# EAGLE design Schematic (EAGLE 9.6.2)
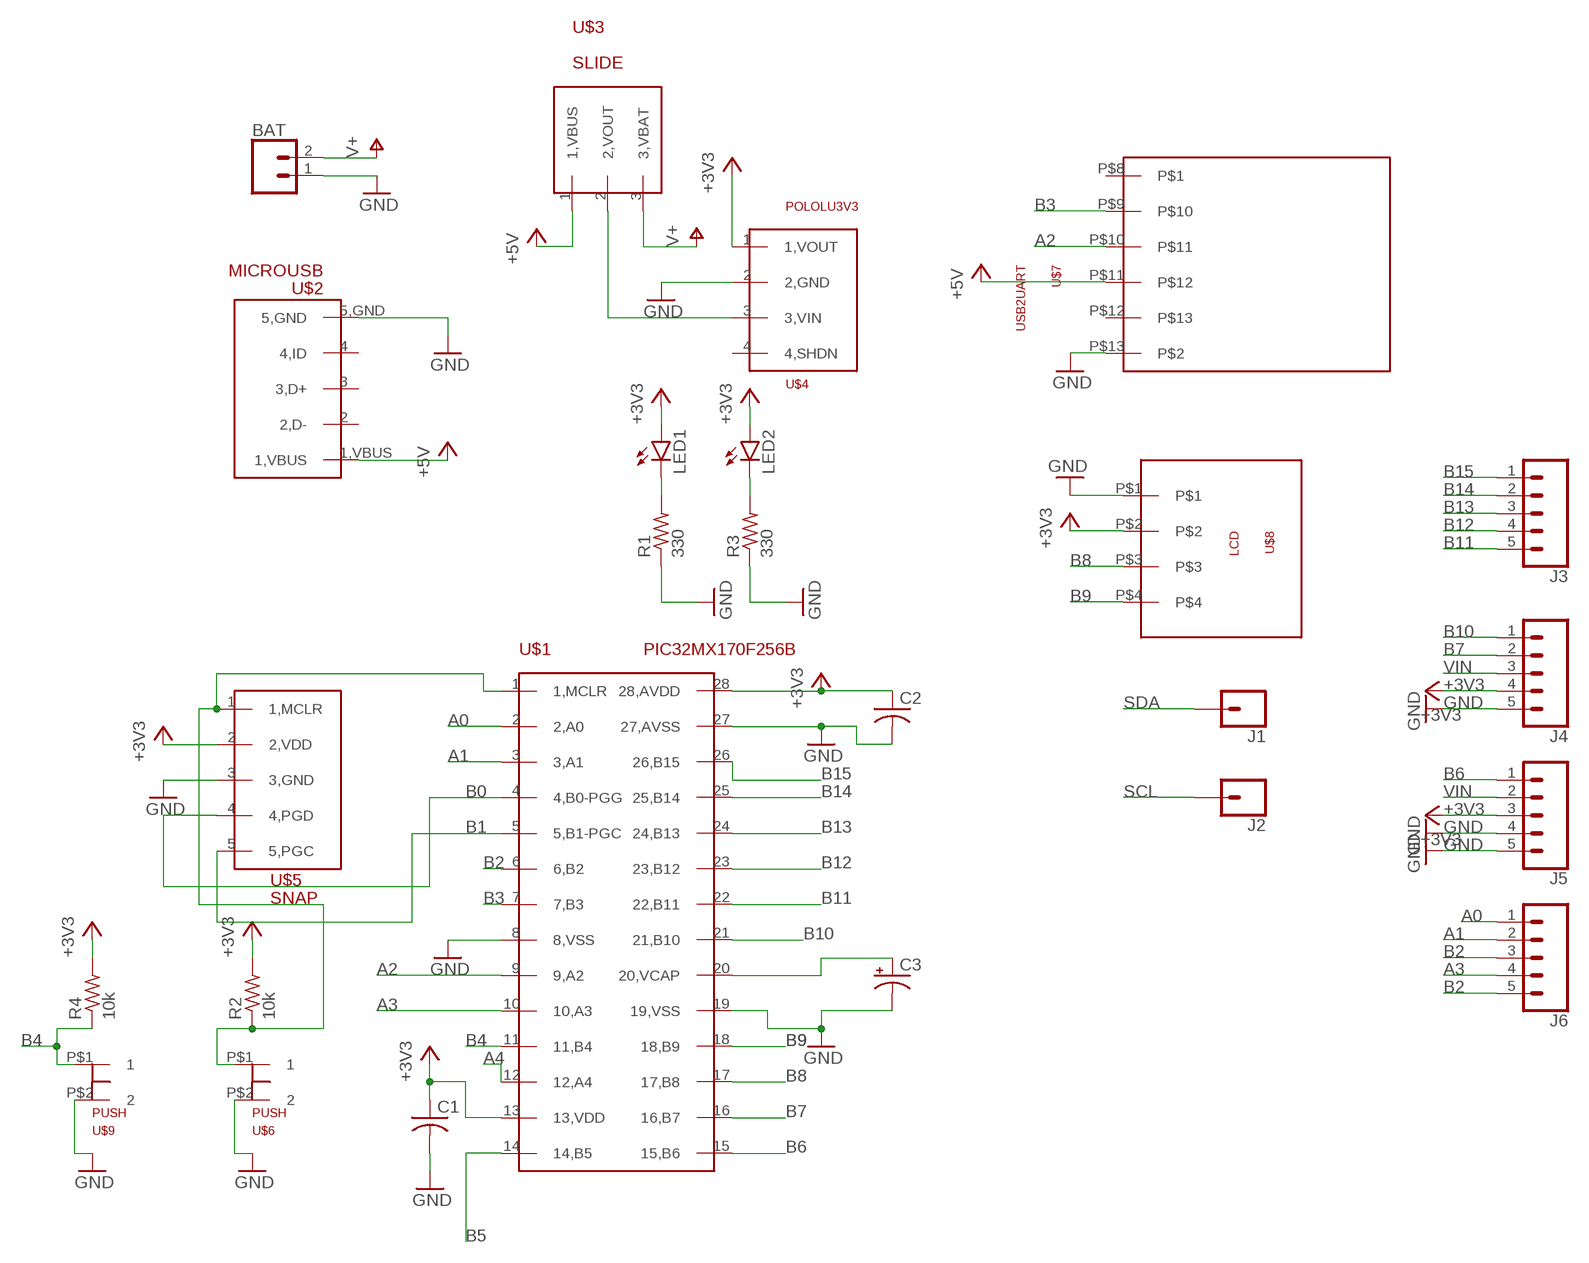
[diagram p0: schematic, sheet 1]

## Parts
BAT  CONN_02  [1X02]
C1  C-US025-030X050  [C025-030X050]
C2  C-US025-030X050  [C025-030X050]
C3  CPOL-USB45181B  [B45181B]
J1  CONN_01  [1X01]
J2  CONN_01  [1X01]
J3  CONN_05  [1X05]
J4  CONN_05  [1X05]
J5  CONN_05  [1X05]
J6  CONN_05  [1X05]
LED1  LED3MM  [LED3MM]
LED2  LED3MM  [LED3MM]
R1  330  R-US_0207/10  [0207/10]
R2  10k  R-US_0207/10  [0207/10]
R3  330  R-US_0207/10  [0207/10]
R4  10k  R-US_0207/10  [0207/10]
U$1  PIC32MX170F256B  [DIL28-3]
U$2  MICROUSB  [MICROUSB]
U$3  SLIDE  [SLIDE]
U$4  POLOLU3V3  [POLOLU3V3]
U$5  SNAP  [SNAP]
U$6  PUSH  [PUSH]
U$7  USB2UART  [USB2UART]
U$8  LCD  [LCD]
U$9  PUSH  [PUSH]

## Nets
+3V3: C1.1 C2.1 J4.4 J5.3 LED1.A LED2.A R2.2 R4.2 U$1.13(13,VDD) U$1.28(28,AVDD) U$4.1(1,VOUT) U$5.2(2,VDD) U$8.P$2
+5V: U$2.1,VBUS U$3.1(1,VBUS) U$7.P$11
A0: J6.1 U$1.2(2,A0)
A1: J6.2 U$1.3(3,A1)
A2: U$1.9(9,A2) U$7.P$10
A3: J6.4 U$1.10(10,A3)
A4: U$1.12(12,A4)
B0: U$1.4(4,B0-PGG) U$5.4(4,PGD)
B1: U$1.5(5,B1-PGC) U$5.5(5,PGC)
B2: J6.3 J6.5 U$1.6(6,B2)
B3: U$1.7(7,B3) U$7.P$9
B4: R4.1 U$1.11(11,B4) U$9.P$1
B5: U$1.14(14,B5)
B6: J5.1 U$1.15(15,B6)
B7: J4.2 U$1.16(16,B7)
B8: U$1.17(17,B8) U$8.P$3
B9: U$1.18(18,B9) U$8.P$4
B10: J4.1 U$1.21(21,B10)
B11: J3.5 U$1.22(22,B11)
B12: J3.4 U$1.23(23,B12)
B13: J3.3 U$1.24(24,B13)
B14: J3.2 U$1.25(25,B14)
B15: J3.1 U$1.26(26,B15)
GND: BAT.1 C1.2 C2.2 C3.- J4.5 J5.4 J5.5 R1.1 R3.1 U$1.8(8,VSS) U$1.19(19,VSS) U$1.27(27,AVSS) U$2.5,GND U$4.2(2,GND) U$5.3(3,GND) U$6.P$2 U$7.P$13 U$8.P$1 U$9.P$2
N$1: U$3.2(2,VOUT) U$4.3(3,VIN)
N$2: LED1.K(C) R1.2
N$3: R2.1 U$1.1(1,MCLR) U$5.1(1,MCLR) U$6.P$1
N$4: LED2.K(C) R3.2
N$7: C3.+ U$1.20(20,VCAP)
SCL: J2.1
SDA: J1.1
V+: BAT.2 U$3.3(3,VBAT)
VIN: J4.3 J5.2
Unconnected: U$2.2(2,D-) U$2.3(3,D+) U$2.4(4,ID) U$4.4(4,SHDN) U$7.P$8 U$7.P$12

## Library data of the parts
BAT = Library:CONN_02: Multi connection point. Often used as Generic Header-pin footprint for 0.1 inch spaced/style header connections On any of the 0.1 inch spaced packages, you can populate with these: Break Away Headers - Straight <https://www.sparkfun.com/products/116> (PRT-00116) Break Away Male Headers - Right Angle <https://www.sparkfun.com/products/553> (PRT-00553) Female Headers <https://www.sparkfun.com/products/115> (PRT-00115) Break Away Headers - Machine Pin <https://www.sparkfun.com/products/117> (PRT-00117) Break Away Female Headers - Swiss Machine Pin <https://www.sparkfun.com/products/743> (PRT-00743) For SCREWTERMINALS and SPRING TERMINALS visit here: Screw Terimnals on SparkFun.com <https://www.sparkfun.com/search/results?term=Screw+Terminals> (5mm/3.5mm/2.54mm spacing) This device is also useful as a general connection point to wire up your design to another part of your project. Our various solder wires solder well into these plated through hole pads. Hook-Up Wire - Assortment (Stranded, 22 AWG) <https://www.sparkfun.com/products/11375> (PRT-11375) Hook-Up Wire - Assortment (Solid Core, 22 AWG) <https://www.sparkfun.com/products/11367> (PRT-11367) View the entire wire category on our website here <https://www.sparkfun.com/categories/141> Special notes: Molex polarized connector foot print use with: PRT-08233 with associated crimp pins and housings. 2.54_SCREWTERM for use with PRT-10571. 3.5mm Screw Terminal footprints for PRT-08084 5mm Screw Terminal footprints for use with PRT-08432
C1 C2 = Library:C-US: CAPACITOR, American symbol; SPICEPREFIX: C
C3 = Library:CPOL-US: POLARIZED CAPACITOR, American symbol; SPICEPREFIX: C
J1 J2 = Library:CONN_01: Single connection point. Often used as Generic Header-pin footprint for 0.1 inch spaced/style header connections On any of the 0.1 inch spaced packages, you can populate with these: Break Away Headers - Straight <https://www.sparkfun.com/products/116> (PRT-00116) Break Away Male Headers - Right Angle <https://www.sparkfun.com/products/553> (PRT-00553) Female Headers <https://www.sparkfun.com/products/115> (PRT-00115) Break Away Headers - Machine Pin <https://www.sparkfun.com/products/117> (PRT-00117) Break Away Female Headers - Swiss Machine Pin <https://www.sparkfun.com/products/743> (PRT-00743) This device is also useful as a general connection point to wire up your design to another part of your project. Our various solder wires solder well into these plated through hole pads. Hook-Up Wire - Assortment (Stranded, 22 AWG) <https://www.sparkfun.com/products/11375> (PRT-11375) Hook-Up Wire - Assortment (Solid Core, 22 AWG) <https://www.sparkfun.com/products/11367> (PRT-11367) View the entire wire category on our website here <https://www.sparkfun.com/categories/141> Special notes: SMTSO-256-ET is a "flush mount" nut for a 4-40 screw. We mostly use this on specialty testbeds; it is a nice way to connect hardware to your PCB at an adjustable hieght. Also note, the SNAP packages are for using a snappable style connector. We sell a baggie of snaps and they are also used on two LilyPad designs: Snap Assortment - 30 pack (male and female) <https://www.sparkfun.com/products/11347> (DEV-11347) LilyPad Arduino SimpleSnap <https://www.sparkfun.com/products/10941> (DEV-10941) LilyPad SimpleSnap Protoboard <https://www.sparkfun.com/products/10940> (DEV-10940)
J3-J6 = Library:CONN_05: Multi connection point. Often used as Generic Header-pin footprint for 0.1 inch spaced/style header connections On any of the 0.1 inch spaced packages, you can populate with these: Break Away Headers - Straight <https://www.sparkfun.com/products/116> (PRT-00116) Break Away Male Headers - Right Angle <https://www.sparkfun.com/products/553> (PRT-00553) Female Headers <https://www.sparkfun.com/products/115> (PRT-00115) Break Away Headers - Machine Pin <https://www.sparkfun.com/products/117> (PRT-00117) Break Away Female Headers - Swiss Machine Pin <https://www.sparkfun.com/products/743> (PRT-00743) For SCREWTERMINALS and SPRING TERMINALS visit here: Screw Terimnals on SparkFun.com <https://www.sparkfun.com/search/results?term=Screw+Terminals> (5mm/3.5mm/2.54mm spacing) This device is also useful as a general connection point to wire up your design to another part of your project. Our various solder wires solder well into these plated through hole pads. Hook-Up Wire - Assortment (Stranded, 22 AWG) <https://www.sparkfun.com/products/11375> (PRT-11375) Hook-Up Wire - Assortment (Solid Core, 22 AWG) <https://www.sparkfun.com/products/11367> (PRT-11367) View the entire wire category on our website here <https://www.sparkfun.com/categories/141> Special notes: Molex polarized connector foot print use with SKU : PRT-08231 with associated crimp pins and housings. 1MM SMD Version SKU: PRT-10208
LED1 LED2 = Library:LED: LED OSRAM: - CHIPLED LG R971, LG N971, LY N971, LG Q971, LY Q971, LO R971, LY R971 LH N974, LH R974 LS Q976, LO Q976, LY Q976 LO Q996 - Hyper CHIPLED LW Q18S LB Q993, LB Q99A, LB R99A - SideLED LS A670, LO A670, LY A670, LG A670, LP A670 LB A673, LV A673, LT A673, LW A673 LH A674 LY A675 LS A676, LA A676, LO A676, LY A676, LW A676 LS A679, LY A679, LG A679 - Hyper Micro SIDELED® LS Y876, LA Y876, LO Y876, LY Y876 LT Y87S - SmartLED LW L88C, LW L88S LB L89C, LB L89S, LG L890 LS L89K, LO L89K, LY L89K LS L896, LA L896, LO L896, LY L896 - TOPLED LS T670, LO T670, LY T670, LG T670, LP T670 LSG T670, LSP T670, LSY T670, LOP T670, LYG T670 LG T671, LOG T671, LSG T671 LB T673, LV T673, LT T673, LW T673 LH T674 LS T676, LA T676, LO T676, LY T676, LB T676, LH T676, LSB T676, LW T676 LB T67C, LV T67C, LT T67C, LS T67K, LO T67K, LY T67K, LW E67C LS E67B, LA E67B, LO E67B, LY E67B, LB E67C, LV E67C, LT E67C LW T67C LS T679, LY T679, LG T679 LS T770, LO T770, LY T770, LG T770, LP T770 LB T773, LV T773, LT T773, LW T773 LH T774 LS E675, LA E675, LY E675, LS T675 LS T776, LA T776, LO T776, LY T776, LB T776 LHGB T686 LT T68C, LB T68C - Hyper Mini TOPLED® LB M676 - Mini TOPLED Santana® LG M470 LS M47K, LO M47K, LY M47K Source: http://www.osram.convergy.de LUXEON: - LUMILED® LXK2-PW12-R00, LXK2-PW12-S00, LXK2-PW14-U00, LXK2-PW14-V00 LXK2-PM12-R00, LXK2-PM12-S00, LXK2-PM14-U00 LXK2-PE12-Q00, LXK2-PE12-R00, LXK2-PE12-S00, LXK2-PE14-T00, LXK2-PE14-U00 LXK2-PB12-K00, LXK2-PB12-L00, LXK2-PB12-M00, LXK2-PB14-N00, LXK2-PB14-P00, LXK2-PB14-Q00 LXK2-PR12-L00, LXK2-PR12-M00, LXK2-PR14-Q00, LXK2-PR14-R00 LXK2-PD12-Q00, LXK2-PD12-R00, LXK2-PD12-S00 LXK2-PH12-R00, LXK2-PH12-S00 LXK2-PL12-P00, LXK2-PL12-Q00, LXK2-PL12-R00 Source: www.luxeon.com KINGBRIGHT: KA-3528ASYC Source: www.kingbright.com
R1-R4 = Library:R-US_: RESISTOR, American symbol; SPICEPREFIX: R
U$1 = Library:PIC32MX170F256B
U$2 = Library:MICROUSB
U$3 = Library:SLIDE
U$4 = Library:POLOLU3V3
U$5 = Library:SNAP
U$6 U$9 = Library:PUSH
U$7 = Library:USB2UART
U$8 = Library:LCD

## Board
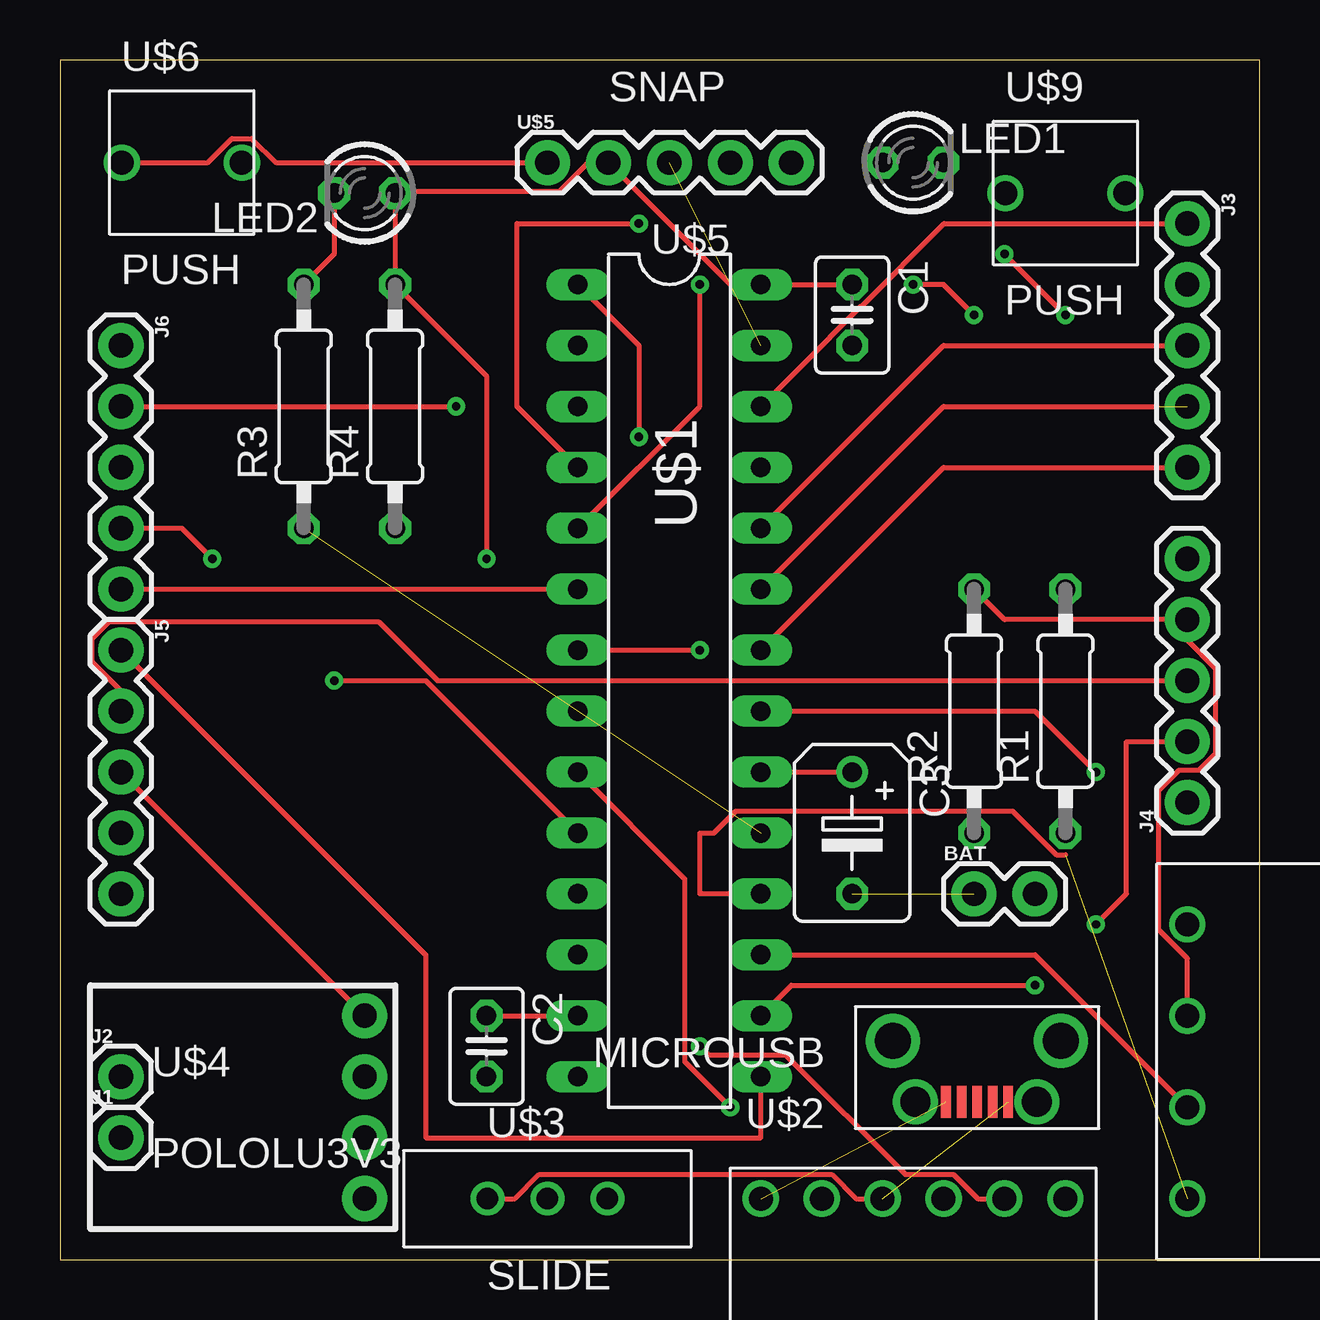
[diagram p1: board, top side]
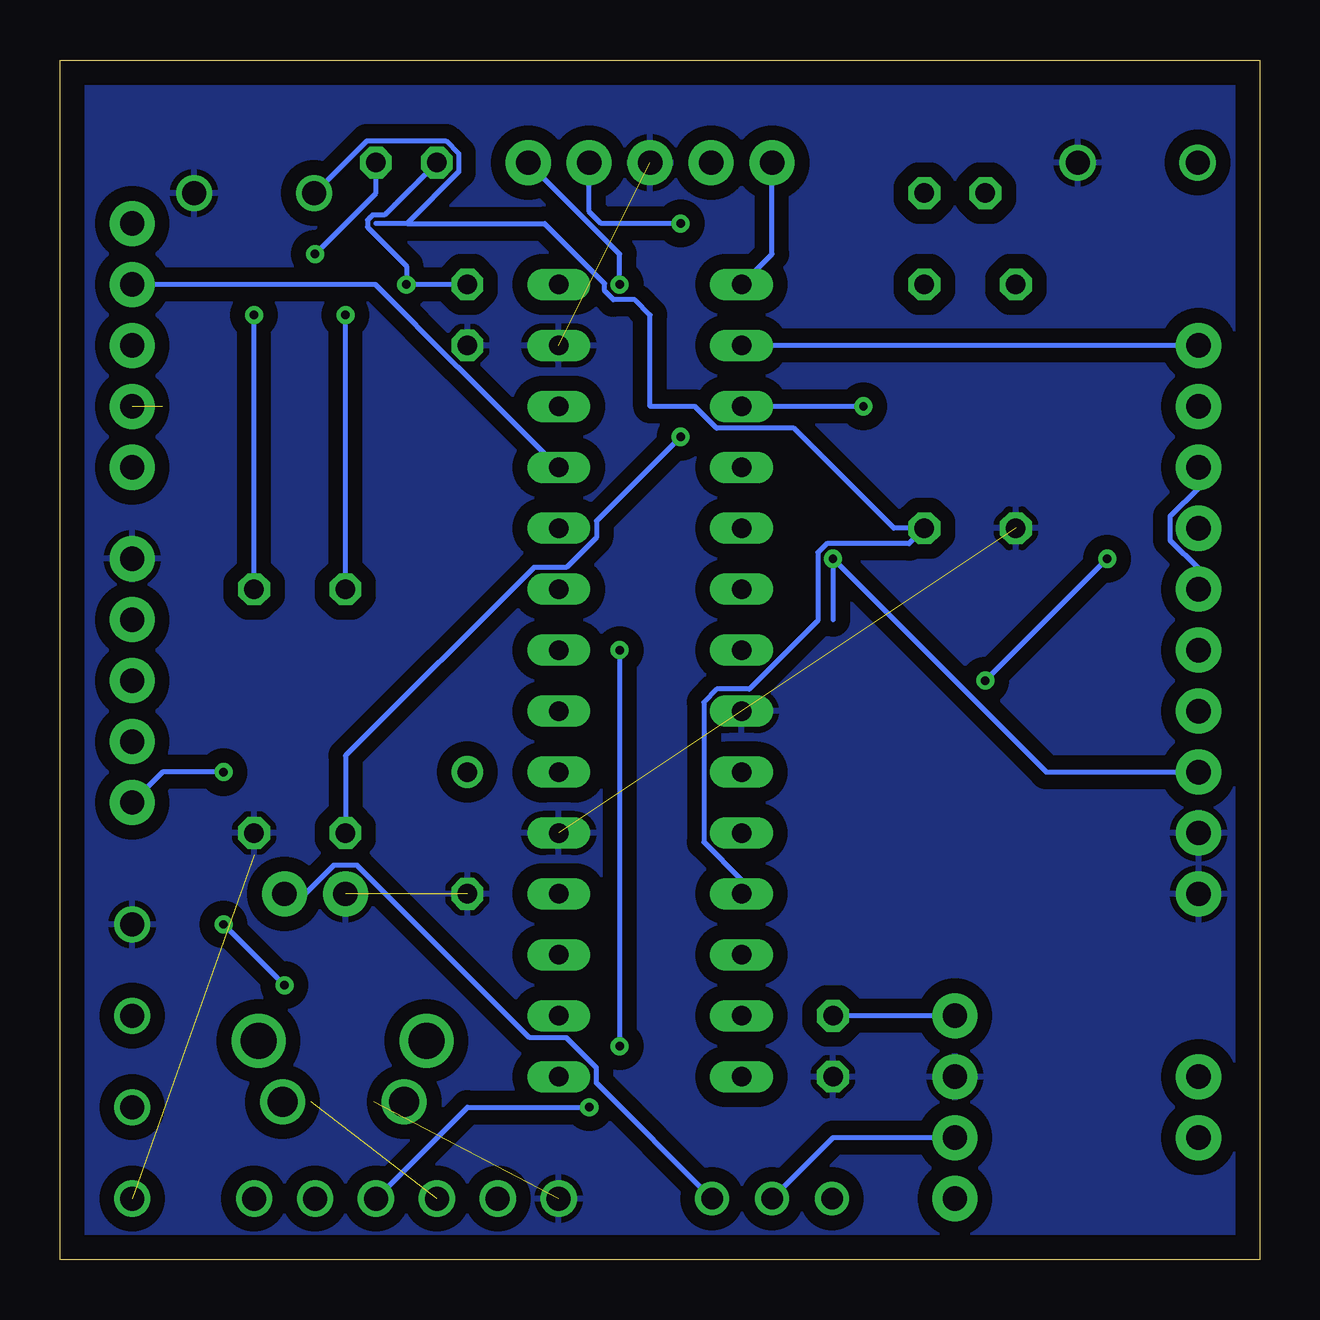
[diagram p2: board, bottom side, seen from below]

Size 50 x 50 mm. Coordinates in mm from the lower left corner, seen from the top.
Outline: 0,0 50,0 50,50 0,50 0,0
Copper layers (1*16): Top 0.035mm / dielectric 1.5mm / Bottom 0.035mm
Design rules "default": minimum track width 6mil, minimum drill 0.35mm, track to track 6mil, track to pad 6mil, pad to pad 6mil, via to via 6mil, smd to smd 6mil, copper to edge 40mil, drill to drill 6mil, minimum pad ring 10mil, minimum via ring 8mil, stop-mask expansion 4mil, vias tented up to drill 0mil, thermal gap 10mil

### Footprints (pad centres in the part's own frame; a part is rotated, then mirrored left to right if it is on the bottom)
1X02 = drill 1.016 pad 1.88: 1 0,0; 2 2.54,0
C025-030X050 = drill 0.813 octagon: 1 -1.27,0; 2 1.27,0
B45181B = drill 0.813: + -2.54,0 | drill 0.813 octagon: - 2.54,0
1X01 = drill 1.016 pad 1.88: 1 0,0
1X05 = drill 1.016 pad 1.88: 1 0,0; 2 2.54,0; 3 5.08,0; 4 7.62,0; 5 10.16,0
LED3MM = drill 0.813 octagon: A -1.27,0; K 1.27,0
0207/10 = drill 0.813 octagon: 1 -5.08,0; 2 5.08,0
DIL28-3 = drill 0.813 long: 1 -16.51,-3.81; 2 -13.97,-3.81; 3 -11.43,-3.81; 4 -8.89,-3.81; 5 -6.35,-3.81; 6 -3.81,-3.81; 7 -1.27,-3.81; 8 1.27,-3.81; 9 3.81,-3.81; 10 6.35,-3.81; 11 8.89,-3.81; 12 11.43,-3.81; 13 13.97,-3.81; 14 16.51,-3.81; 15 16.51,3.81; 16 13.97,3.81; 17 11.43,3.81; 18 8.89,3.81; 19 6.35,3.81; 20 3.81,3.81; 21 1.27,3.81; 22 -1.27,3.81; 23 -3.81,3.81; 24 -6.35,3.81; 25 -8.89,3.81; 26 -11.43,3.81; 27 -13.97,3.81; 28 -16.51,3.81
MICROUSB = smd 0.4 x 1.35: 1,VBUS -1.3,2.7; 2 -0.65,2.7; 3 0,2.7; 4 0.65,2.7; 5,GND 1.3,2.7 | drill 1.25 pad 1.676: P$6 -2.5,2.7; P$8 2.58,2.7 | drill 1.5: P$7 -3.5,0.16; P$9 3.5,0.16
SLIDE = drill 0.9: 1 -2.5,0; 2 0,0; 3 2.5,0
POLOLU3V3 = drill 1.016 pad 1.88: 1 0,3.81; 2 0,1.27; 3 0,-1.27; 4 0,-3.81
SNAP = drill 1.016 pad 1.88: 1 -5.08,0; 2 -2.54,0; 3 0,0; 4 2.54,0; 5 5.08,0
PUSH = drill 1: P$1 -2.5,0; P$2 2.5,0
USB2UART = drill 1: P$8 -6.35,-8.89; P$9 -3.81,-8.89; P$10 -1.27,-8.89; P$11 1.27,-8.89; P$12 3.81,-8.89; P$13 6.35,-8.89
LCD = drill 1: P$1 1.27,-5.08; P$2 5.08,-5.08; P$3 8.89,-5.08; P$4 12.7,-5.08

### Placement (x,y rotation side)
BAT  38.1,15.24 0 top
C1  33.02,39.37 270 top
C2  17.78,8.89 270 top
C3  33.02,17.78 270 top
J1  2.54,5.08 0 top
J2  2.54,7.62 0 top
J3  46.99,43.18 270 top
J4  46.99,19.05 90 top
J5  2.54,25.4 270 top
J6  2.54,38.1 270 top
LED1  35.56,45.72 0 top
LED2  12.7,44.45 180 top
R1  41.91,22.86 90 top
R2  38.1,22.86 90 top
R3  10.16,35.56 90 top
R4  13.97,35.56 90 top
U$1  25.4,24.13 270 top
U$2  38.23,9.27 180 top
U$3  20.32,2.54 0 top
U$4  12.7,6.35 0 top
U$5  25.4,45.72 0 top
U$6  5.08,45.72 0 top
U$7  35.56,-6.35 180 top
U$8  52.07,15.24 270 top
U$9  41.91,44.45 0 top

### Tracks (layer width: path | path; a pad name or v marks a point on that pad's centre or on a via)
+3V3  (via drill 0.35)
  Top 0.2: C2.1 U$1.13 | C1.1 U$1.28 27.94,40.64 U$5.2 22.01,45.72 20.81,44.53 14.05,44.53 LED2.A R4.2 17.78,36.83 v17.78,29.21 | J5.3 U$4.1 | R2.2 39.37,26.67 J4.4 46.99,25.82 48.18,24.62 48.18,21.1 47.48,20.4 46.65,20.4 45.8,19.54 45.8,13.74 46.99,12.55 U$8.P$2 | v38.1,39.37 36.83,40.64 v35.56,40.64
  Bottom 0.2: 17.78,26.67 v17.78,29.21 8.89,20.32 J5.3 | R2.2 v38.1,39.37 | U$4.1 C2.1 | C1.1 v35.56,40.64 35.56,41.41 37.18,43.03 37.18,43.33 36.98,43.53 36.48,43.53 LED1.A
+5V  (1 unrouted)
  Top 0.2: U$3.1 18.97,2.54 19.97,3.55 32.17,3.55 33.17,2.54 U$7.P$11
A0
  Bottom 0.2: J6.1 U$1.2
A1  (via drill 0.35)
  Top 0.2: J6.2 v16.51,35.56
  Bottom 0.2: v16.51,35.56 U$1.3
A2  (via drill 0.35)
  Top 0.2: U$1.9 26.04,15.87 26.04,8.25 v27.94,6.35
  Bottom 0.2: U$7.P$10 33.02,6.35 v27.94,6.35
A3  (via drill 0.35)
  Top 0.2: J6.4 5.08,30.48 v6.35,29.21 | v11.43,24.13 15.24,24.13 U$1.10
  Bottom 0.2: v6.35,29.21 v11.43,24.13
B0  (via drill 0.35)
  Top 0.2: U$1.4 19.05,35.56 19.05,43.18 v24.13,43.18
  Bottom 0.2: v24.13,43.18 27.44,43.18 27.94,43.68 U$5.4
B1  (via drill 0.35)
  Top 0.2: U$1.5 26.67,35.56 v26.67,40.64
  Bottom 0.2: v26.67,40.64 26.67,41.91 U$5.5
B2
  Top 0.2: J6.5 U$1.6
  Bottom 0.2: J6.3 2.54,32.17 3.73,30.97 3.73,29.99 2.54,28.79 J6.5
B3  (via drill 0.35)
  Top 0.2: U$1.7 v26.67,25.4 | v26.67,8.89 27.03,8.53 30.25,8.53 35.23,3.55 37.25,3.55 38.25,2.54 U$7.P$9
  Bottom 0.2: v26.67,25.4 v26.67,8.89
B4
  Bottom 0.2: U$1.11 21.59,15.83 23.16,17.4 23.16,23.24 22.63,23.77 21.27,23.77 18.41,26.63 18.41,29.47 18.04,29.84 14.61,29.84 R4.1 15.24,30.48 19.41,34.65 22.63,34.65 23.54,35.56 25.4,35.56 25.4,39.37 26.04,40.01 26.93,40.01 27.3,40.38 27.3,40.68 29.8,43.18 35.54,43.18 | U$9.P$1 39.39,44.45 37.21,46.63 33.91,46.63 33.38,46.1 33.38,45.34 35.54,43.18 | 35.54,43.18 36.83,43.18
B6
  Top 0.2: J5.1 15.24,12.7 15.24,5.08 29.21,5.08 U$1.15
B7  (via drill 0.35)
  Top 0.2: U$1.16 30.48,11.43 v40.64,11.43 | v43.18,13.97 44.45,15.24 44.45,21.59 J4.2
  Bottom 0.2: v40.64,11.43 v43.18,13.97
B8
  Top 0.2: U$1.17 40.64,12.7 U$8.P$3
B9  (1 unrouted)
  Top 0.2: U$1.18 26.67,15.24 26.67,17.78 27.26,17.78 28.17,18.69 39.71,18.69 41.53,16.87 41.91,16.87
B10  (via drill 0.35)
  Top 0.2: U$1.21 40.64,22.86 v43.18,20.32
  Bottom 0.2: v43.18,20.32 45.72,20.32 J4.1
B11
  Top 0.2: U$1.22 36.83,33.02 J3.5
B12  (1 unrouted)
  Top 0.2: U$1.23 36.83,35.56 45.72,35.56
B13
  Top 0.2: U$1.24 36.83,38.1 J3.3
B14
  Bottom 0.2: U$1.25 33.38,37.19 33.4,37.19 36.85,40.64 J3.2
B15
  Top 0.2: U$1.26 32.11,38.46 32.11,38.48 33.36,39.73 33.4,39.73 36.85,43.18 J3.1
GND  (5 unrouted)
  pour Bottom (isolate 0.61): 0,0 50.8,0 50,50 0,50 0,34.29
N$1
  Bottom 0.2: U$4.3 17.78,5.08 U$3.2
N$2  (via drill 0.35)
  Top 0.2: v41.91,39.37 v39.37,41.91
  Bottom 0.2: R1.2 v41.91,39.37 | v39.37,41.91 36.83,44.45 LED1.K
N$3  (via drill 0.35)
  Top 0.2: U$6.P$1 6.16,45.72 7.16,46.73 8,46.73 9,45.72 U$5.1 | U$1.1 24.13,38.1 v24.13,34.29
  Bottom 0.2: U$1.1 20.32,41.91 U$5.1 | v24.13,34.29 27.64,30.78 27.64,30.1 28.89,28.85 30.25,28.85 38.1,21 R2.1
N$4
  Top 0.2: LED2.K 11.43,41.91 R3.2
N$7
  Top 0.2: U$1.20 C3.+
V+
  Bottom 0.2: U$3.3 27.64,7.36 27.64,8 28.89,9.25 30.42,9.25 37.61,16.43 38.59,16.43 39.79,15.24 BAT.2
VIN
  Top 0.2: J4.3 15.74,24.13 13.28,26.59 2.05,26.59 1.35,25.89 1.35,24.91 2.54,23.71 J5.2